# Altium schematic sheet [02]Solenoid Driver.SchDoc
size A3
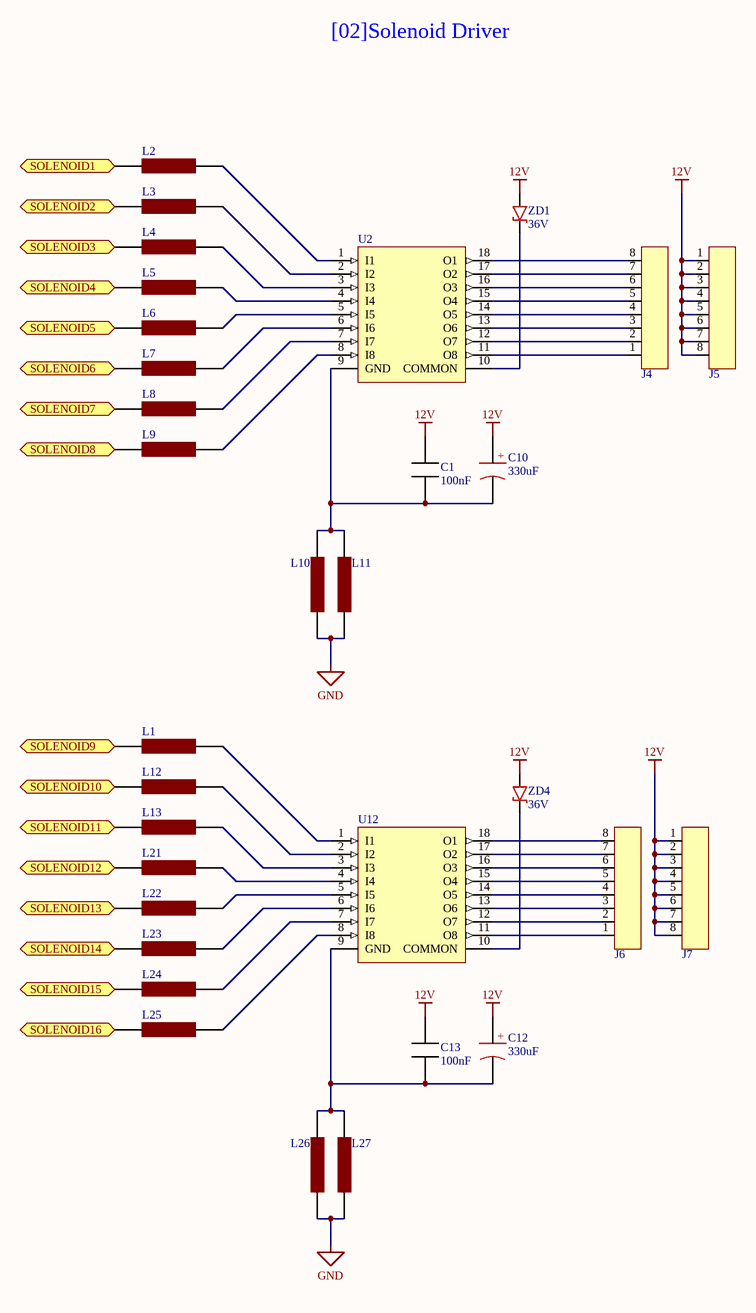
[diagram p0: [02]Solenoid Driver.SchDoc]

## Parts
C1  100nF  [CAPC2012X09N]
C10  330uF  [CAPAE137130X140M]
C12  330uF  [CAPAE137130X140M]
C13  100nF  [CAPC2012X09N]
J4  1771156  [1771156]  (value not drawn)
J5  1771156  [1771156]  (value not drawn)
J6  1771156  [1771156]  (value not drawn)
J7  1771156  [1771156]  (value not drawn)
L1  MH2029-300Y  [INDC2012X11N]  (value not drawn)
L2  MH2029-300Y  [INDC2012X11N]  (value not drawn)
L3  MH2029-300Y  [INDC2012X11N]  (value not drawn)
L4  MH2029-300Y  [INDC2012X11N]  (value not drawn)
L5  MH2029-300Y  [INDC2012X11N]  (value not drawn)
L6  MH2029-300Y  [INDC2012X11N]  (value not drawn)
L7  MH2029-300Y  [INDC2012X11N]  (value not drawn)
L8  MH2029-300Y  [INDC2012X11N]  (value not drawn)
L9  MH2029-300Y  [INDC2012X11N]  (value not drawn)
L10  MH2029-300Y  [INDC2012X11N]  (value not drawn)
L11  MH2029-300Y  [INDC2012X11N]  (value not drawn)
L12  MH2029-300Y  [INDC2012X11N]  (value not drawn)
L13  MH2029-300Y  [INDC2012X11N]  (value not drawn)
L21  MH2029-300Y  [INDC2012X11N]  (value not drawn)
L22  MH2029-300Y  [INDC2012X11N]  (value not drawn)
L23  MH2029-300Y  [INDC2012X11N]  (value not drawn)
L24  MH2029-300Y  [INDC2012X11N]  (value not drawn)
L25  MH2029-300Y  [INDC2012X11N]  (value not drawn)
L26  MH2029-300Y  [INDC2012X11N]  (value not drawn)
L27  MH2029-300Y  [INDC2012X11N]  (value not drawn)
U2  TBD62083A  [TSOP65P640X155-18N]  (value not drawn)
U12  TBD62083A  [TSOP65P640X155-18N]  (value not drawn)
ZD1  36V  [SOT95P237X111-3N]
ZD4  36V  [SOT95P237X111-3N]

## Ports
SOLENOID1 (bidir), SOLENOID2 (bidir), SOLENOID3 (bidir), SOLENOID4 (bidir), SOLENOID5 (bidir), SOLENOID6 (bidir), SOLENOID7 (bidir), SOLENOID8 (bidir), SOLENOID9 (bidir), SOLENOID10 (bidir), SOLENOID11 (bidir), SOLENOID12 (bidir), SOLENOID13 (bidir), SOLENOID14 (bidir), SOLENOID15 (bidir), SOLENOID16 (bidir)

## Nets
12V: C1.2 C10.1 C12.1 C13.2 J5.1 J5.2 J5.3 J5.4 J5.5 J5.6 J5.7 J5.8 J7.1 J7.2 J7.3 J7.4 J7.5 J7.6 J7.7 J7.8 ZD1.A ZD4.A
GND: L10.1 L11.1 L26.1 L27.1
SOLENOID1: L2.1 ; port SOLENOID1
SOLENOID2: L3.1 ; port SOLENOID2
SOLENOID3: L4.1 ; port SOLENOID3
SOLENOID4: L5.1 ; port SOLENOID4
SOLENOID5: L6.1 ; port SOLENOID5
SOLENOID6: L7.1 ; port SOLENOID6
SOLENOID7: L8.1 ; port SOLENOID7
SOLENOID8: L9.1 ; port SOLENOID8
SOLENOID9: L1.1 ; port SOLENOID9
SOLENOID10: L12.1 ; port SOLENOID10
SOLENOID11: L13.1 ; port SOLENOID11
SOLENOID12: L21.1 ; port SOLENOID12
SOLENOID13: L22.1 ; port SOLENOID13
SOLENOID14: L23.1 ; port SOLENOID14
SOLENOID15: L24.1 ; port SOLENOID15
SOLENOID16: L25.1 ; port SOLENOID16
NetC1_1: C1.1 C10.2 L10.2 L11.2 U2.9(GND)
NetC12_2: C12.2 C13.1 L26.2 L27.2 U12.9(GND)
NetJ4_1: J4.1 U2.11(O8)
NetJ4_2: J4.2 U2.12(O7)
NetJ4_3: J4.3 U2.13(O6)
NetJ4_4: J4.4 U2.14(O5)
NetJ4_5: J4.5 U2.15(O4)
NetJ4_6: J4.6 U2.16(O3)
NetJ4_7: J4.7 U2.17(O2)
NetJ4_8: J4.8 U2.18(O1)
NetJ6_1: J6.1 U12.11(O8)
NetJ6_2: J6.2 U12.12(O7)
NetJ6_3: J6.3 U12.13(O6)
NetJ6_4: J6.4 U12.14(O5)
NetJ6_5: J6.5 U12.15(O4)
NetJ6_6: J6.6 U12.16(O3)
NetJ6_7: J6.7 U12.17(O2)
NetJ6_8: J6.8 U12.18(O1)
NetL1_2: L1.2 U12.1(I1)
NetL2_2: L2.2 U2.1(I1)
NetL3_2: L3.2 U2.2(I2)
NetL4_2: L4.2 U2.3(I3)
NetL5_2: L5.2 U2.4(I4)
NetL6_2: L6.2 U2.5(I5)
NetL7_2: L7.2 U2.6(I6)
NetL8_2: L8.2 U2.7(I7)
NetL9_2: L9.2 U2.8(I8)
NetL12_2: L12.2 U12.2(I2)
NetL13_2: L13.2 U12.3(I3)
NetL21_2: L21.2 U12.4(I4)
NetL22_2: L22.2 U12.5(I5)
NetL23_2: L23.2 U12.6(I6)
NetL24_2: L24.2 U12.7(I7)
NetL25_2: L25.2 U12.8(I8)
NetU2_10: U2.10(COMMON) ZD1.K
NetU12_10: U12.10(COMMON) ZD4.K

## Notes on the sheet
- [02]Solenoid Driver
- (in symbol EMVH350ARA331MKE0S) +

## Library data of the parts
C1 C13 = CL21F104ZBCNNNC: CAP CER 0.1UF 50V Y5V 0805; Manufacturer: Samsung Electro-Mechanics America, Inc.; Capacitance: 0.10µF; Tolerance: -20%, +80%; Temperature Coefficient: Y5V (F); Supplier 1: Digi-Key; Manufacturer Part Number: CL21F104ZBCNNNC; RoHS: RoHS Compliant; Category: Capacitors; Stock 1: 1030146; Pricing 1: 1=0.1, 10=0.031, 25=0.022, 50=0.017, 100=0.0144, 500=0.01004, 1000=0.00783 (USD); Packaging: Cut Tape (CT); Voltage - Rated: 50V; Mounting Type: Surface Mount, MLCC; Operating Temperature: -30°C ~ 85°C; Applications: General Purpose; Ratings: -; Package / Case: 0805 (2012 Metric); Size / Dimension: 0.079" L x 0.049" W (2.00mm x 1.25mm); Height - Seated (Max): -; Thickness (Max): 0.037" (0.95mm); Lead Spacing: -; Features: -; Lead Style: -; ComponentLink1URL: http://www.samsungsem.com/kr/support/product-search/mlcc/CL21F104ZBCNNNC.jsp; ComponentLink1Description: http://www.samsungsem.com/kr/support/product-search/mlcc/CL21F104ZBCNNNC.jsp; Supplier Part Number 1: 1276-1007-1-ND
C10 C12 = EMVH350ARA331MKE0S: CAP ALUM 330UF 20% 35V SMD; Supplier 1: Digi-Key; Supplier Part Number 1: 565-2316-1-ND
J4-J7 = 1771156: CONN TERM BLK 8POS 2.5MM SMD; Manufacturer: Phoenix Contact; Positions Per Level: 8; Pitch: 0.098" (2.50mm); Mating Orientation: Vertical with Board; Wire Gauge: 20-26 AWG; Wire Termination: Screwless - Spring Cage, Tension Clamp; Supplier 1: Digi-Key; Manufacturer Part Number: 1771156; RoHS: RoHS Compliant; Category: Connectors, Interconnects; Stock 1: 2856; Pricing 1: 1=1.39, 10=1.334, 50=1.276, 100=1.2412 (USD); Packaging: Cut Tape (CT); Part Status: Active; Mounting Type: Surface Mount; Features: Solder Retention; Color: Black; Operating Temperature: -; Housing Material: Liquid Crystal Polymer (LCP); Contact Material - Plating: -; Clamp Material - Plating: -; Screw Material - Plating: -; Torque - Screw: -; Screw Thread: -; ComponentLink1URL: https://media.digikey.com/pdf/Data%20Sheets/Phoenix%20Contact%20PDFs/1771156.pdf; ComponentLink1Description: https://media.digikey.com/pdf/Data%20Sheets/Phoenix%20Contact%20PDFs/1771156.pdf; Supplier Part Number 1: 277-2078-1-ND
L1-L13 L21-L27 = MH2029-300Y: EMI Filter Beads, Chips & Arrays Impedance 30ohms IDC 3.0; Manufacturer: Bourns; Maximum DC Current: 3 A; Maximum DC Resistance: 25 mOhms; Tolerance: 25 %; Type: High Current Chip Ferrite Bead; Test Frequency: 100 MHz; Filter Type: Power, Signal Line; Number of Lines: 1; Impedance @ Frequency: 30 Ohm @ 100MHz; Current Rating (Max): 3A; DC Resistance (DCR) (Max): 25 mOhm; Manufacturer Part Number: MH2029-300Y; RoHS: RoHS Compliant; Category: EMI Filter Beads, Chips & Arrays; Pricing 1: 1=0.1, 10=0.062, 25=0.0568, 50=0.051, 100=0.0375, 250=0.02724, 500=0.02498, 1000=0.02157 (USD); Capacitance: -; Height: 0.9 mm; Impedance: 30 Ohms; Length: 2 mm; Operating Temperature Range: - 55 C to + 125 C; Package / Case: 0805 (2012 metric); Packaging: Reel; Product: Ferrite Chip Beads; Termination Style: SMD/SMT; Width: 1.2 mm; Brand: Bourns; Product Category: SMD Ferrite Bead; Standard Pack Qty: 4000; RoHS - Mouser: Y; Minimum Order Quantity: 1; Reeling: True; ComponentLink1URL: http://www.mouser.com/ds/2/54/h-777565.pdf; ComponentLink1Description: http://www.mouser.com/ds/2/54/h-777565.pdf; Supplier 1: Digi-Key; Stock 1: 62738; Ratings: -; Operating Temperature: -55°C ~ 125°C; Mounting Type: Surface Mount; Height (Max): 0.043" (1.10mm); Size / Dimension: 0.079" L x 0.047" W (2.00mm x 1.20mm); ComponentLink2URL: http://www.bourns.com/docs/Product-Datasheets/mh.pdf; ComponentLink2Description: http://www.bourns.com/docs/Product-Datasheets/mh.pdf; Supplier Part Number 1: MH2029-300YCT-ND
U2 U12 = TBD62083A: 8channel source type DMOS transistor array; Supplier 1: Digi-Key; Supplier Part Number 1: TBD62083AFNGELCT-ND
ZD1 ZD4 = BZX84C36LT1G: Zener Diode 36V 225mW ±6%; pin to pad: A>1 K>3; Supplier 1: Digi-Key; Supplier Part Number 1: BZX84C36LT1GOSCT-ND